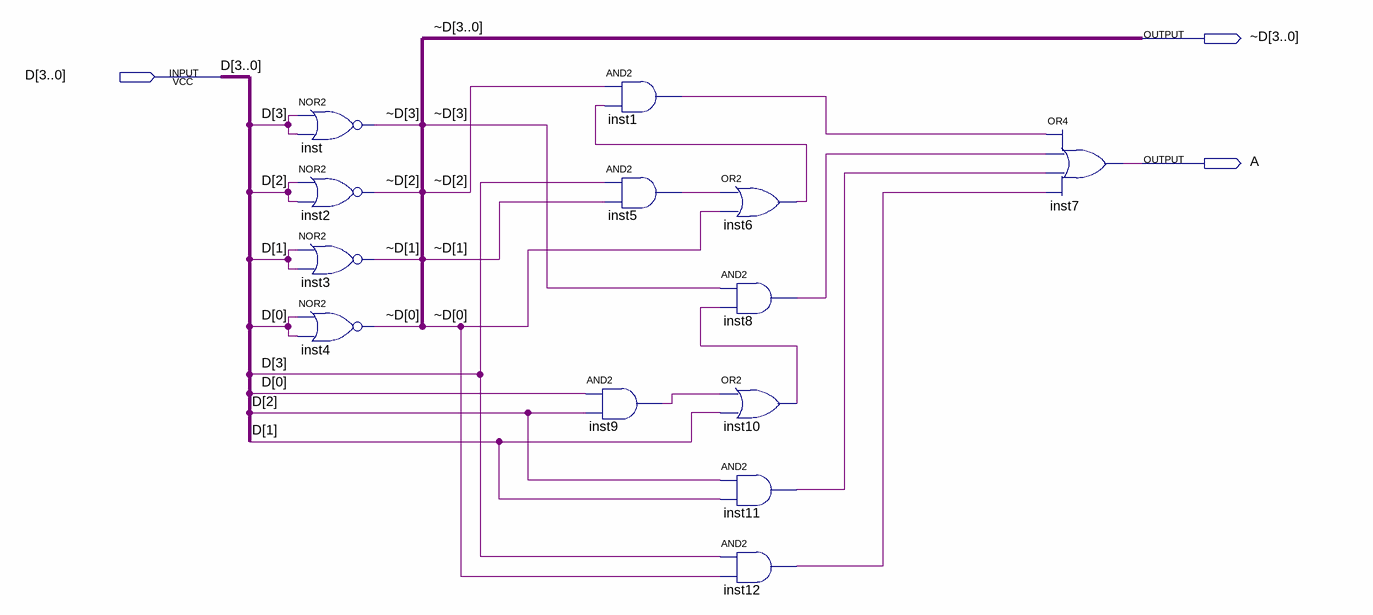
[diagram p0: schematic sheet]
// Quartus schematic SEG_A.bdf as structural Verilog: 13 symbols, 3 pins
module SEG_A (
  input  [3:0] D,
  output [3:0] \~D ,
  output A
);

  wire inst1_out, inst5_out, inst6_out, inst8_out, inst9_out, inst10_out, inst11_out, inst12_out;

  nor inst (\~D [3], D[3], D[3]);
  nor inst2 (\~D [2], D[2], D[2]);
  nor inst3 (\~D [1], D[1], D[1]);
  nor inst4 (\~D [0], D[0], D[0]);
  and inst1 (inst1_out, \~D [2], inst6_out);
  and inst5 (inst5_out, D[3], \~D [1]);
  and inst9 (inst9_out, D[0], D[2]);
  or inst6 (inst6_out, inst5_out, \~D [0]);
  and inst8 (inst8_out, \~D [3], inst10_out);
  or inst10 (inst10_out, inst9_out, D[1]);
  and inst11 (inst11_out, D[2], D[1]);
  and inst12 (inst12_out, D[3], \~D [0]);
  or inst7 (A, inst1_out, inst8_out, inst11_out, inst12_out);
endmodule
